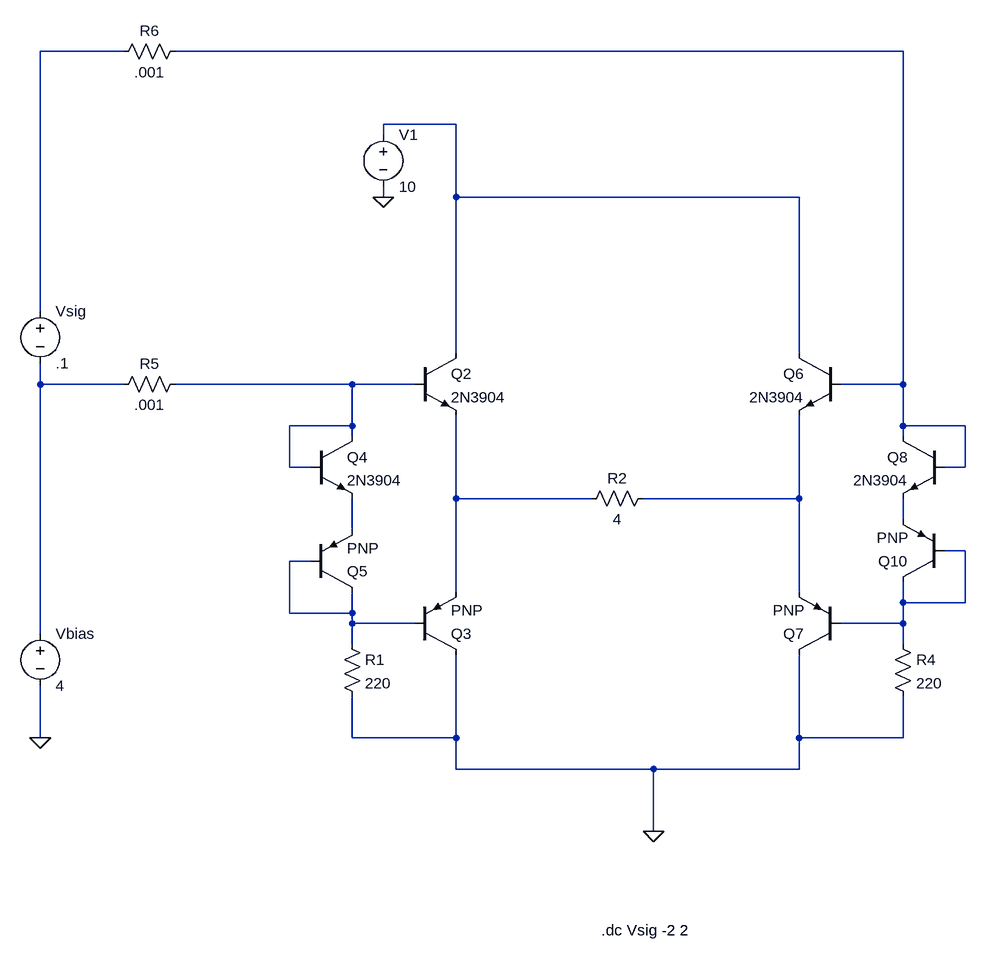
[diagram p0: schematic H-Bridge one.asc]
H-Bridge one.asc, the LTspice schematic file:
Version 4
SHEET 1 1828 900
WIRE 160 -624 32 -624
WIRE 1360 -624 240 -624
WIRE 672 -512 560 -512
WIRE 560 -496 560 -512
WIRE 560 -400 560 -416
WIRE 672 -400 672 -512
WIRE 1200 -400 672 -400
WIRE 32 -224 32 -624
WIRE 672 -160 672 -400
WIRE 1200 -160 1200 -400
WIRE 32 -112 32 -144
WIRE 160 -112 32 -112
WIRE 512 -112 240 -112
WIRE 608 -112 512 -112
WIRE 1360 -112 1360 -624
WIRE 1360 -112 1264 -112
WIRE 512 -48 512 -112
WIRE 512 -48 416 -48
WIRE 1360 -48 1360 -112
WIRE 1456 -48 1360 -48
WIRE 512 -32 512 -48
WIRE 1360 -32 1360 -48
WIRE 416 16 416 -48
WIRE 448 16 416 16
WIRE 1456 16 1456 -48
WIRE 1456 16 1424 16
WIRE 672 64 672 -64
WIRE 880 64 672 64
WIRE 1200 64 1200 -64
WIRE 1200 64 960 64
WIRE 1360 96 1360 64
WIRE 512 112 512 64
WIRE 1456 144 1424 144
WIRE 448 160 416 160
WIRE 672 208 672 64
WIRE 1200 208 1200 64
WIRE 1360 224 1360 192
WIRE 1456 224 1456 144
WIRE 1456 224 1360 224
WIRE 416 240 416 160
WIRE 512 240 512 208
WIRE 512 240 416 240
WIRE 512 256 512 240
WIRE 608 256 512 256
WIRE 1360 256 1360 224
WIRE 1360 256 1264 256
WIRE 32 272 32 -112
WIRE 512 288 512 256
WIRE 1360 288 1360 256
WIRE 32 432 32 352
WIRE 512 432 512 368
WIRE 672 432 672 304
WIRE 672 432 512 432
WIRE 1200 432 1200 304
WIRE 1360 432 1360 368
WIRE 1360 432 1200 432
WIRE 672 480 672 432
WIRE 976 480 672 480
WIRE 1200 480 1200 432
WIRE 1200 480 976 480
WIRE 976 576 976 480
FLAG 560 -400 0
FLAG 32 432 0
FLAG 976 576 0
SYMBOL voltage 560 -512 R0
WINDOW 123 0 0 Left 2
WINDOW 39 0 0 Left 2
SYMATTR InstName V1
SYMATTR Value 10
SYMBOL npn 608 -160 R0
SYMATTR InstName Q2
SYMATTR Value 2N3904
SYMBOL res 864 80 R270
WINDOW 0 32 56 VTop 2
WINDOW 3 0 56 VBottom 2
SYMATTR InstName R2
SYMATTR Value 4
SYMBOL pnp 608 304 M180
SYMATTR InstName Q3
SYMBOL npn 448 -32 R0
SYMATTR InstName Q4
SYMATTR Value 2N3904
SYMBOL voltage 32 256 R0
WINDOW 123 0 0 Left 2
WINDOW 39 0 0 Left 2
SYMATTR InstName Vbias
SYMATTR Value 4
SYMBOL npn 1264 -160 M0
SYMATTR InstName Q6
SYMATTR Value 2N3904
SYMBOL pnp 1264 304 R180
SYMATTR InstName Q7
SYMBOL npn 1424 -32 M0
SYMATTR InstName Q8
SYMATTR Value 2N3904
SYMBOL voltage 32 -240 R0
WINDOW 123 0 0 Left 2
WINDOW 39 0 0 Left 2
SYMATTR InstName Vsig
SYMATTR Value .1
SYMBOL res 496 272 R0
SYMATTR InstName R1
SYMATTR Value 220
SYMBOL res 1344 272 R0
SYMATTR InstName R4
SYMATTR Value 220
SYMBOL pnp 448 208 M180
SYMATTR InstName Q5
SYMBOL pnp 1424 192 R180
SYMATTR InstName Q10
SYMBOL res 144 -96 R270
WINDOW 0 32 56 VTop 2
WINDOW 3 0 56 VBottom 2
SYMATTR InstName R5
SYMATTR Value .001
SYMBOL res 144 -608 R270
WINDOW 0 32 56 VTop 2
WINDOW 3 0 56 VBottom 2
SYMATTR InstName R6
SYMATTR Value .001
TEXT 896 728 Left 2 !.dc Vsig -2 2

The netlist it stands for:
* H-Bridge one.asc
V1 N003 0 10
Q2 N003 N005 N006 0 2N3904
R2 N006 N007 4
Q3 0 N011 N006 0 PNP
Q4 N005 N005 N009 0 2N3904
Vbias N004 0 4
Q6 N003 N002 N007 0 2N3904
Q7 0 N010 N007 0 PNP
Q8 N002 N002 N008 0 2N3904
Vsig N001 N004 .1
R1 N011 0 220
R4 N010 0 220
Q5 N011 N011 N009 0 PNP
Q10 N010 N010 N008 0 PNP
R5 N004 N005 .001
R6 N001 N002 .001
.model NPN NPN
.model PNP PNP
.lib standard.bjt
.dc Vsig -2 2
.backanno
.end